# EAGLE design ESP_SIM7000V2.62 (EAGLE 9.6.2)

## Sheet 1 of 2
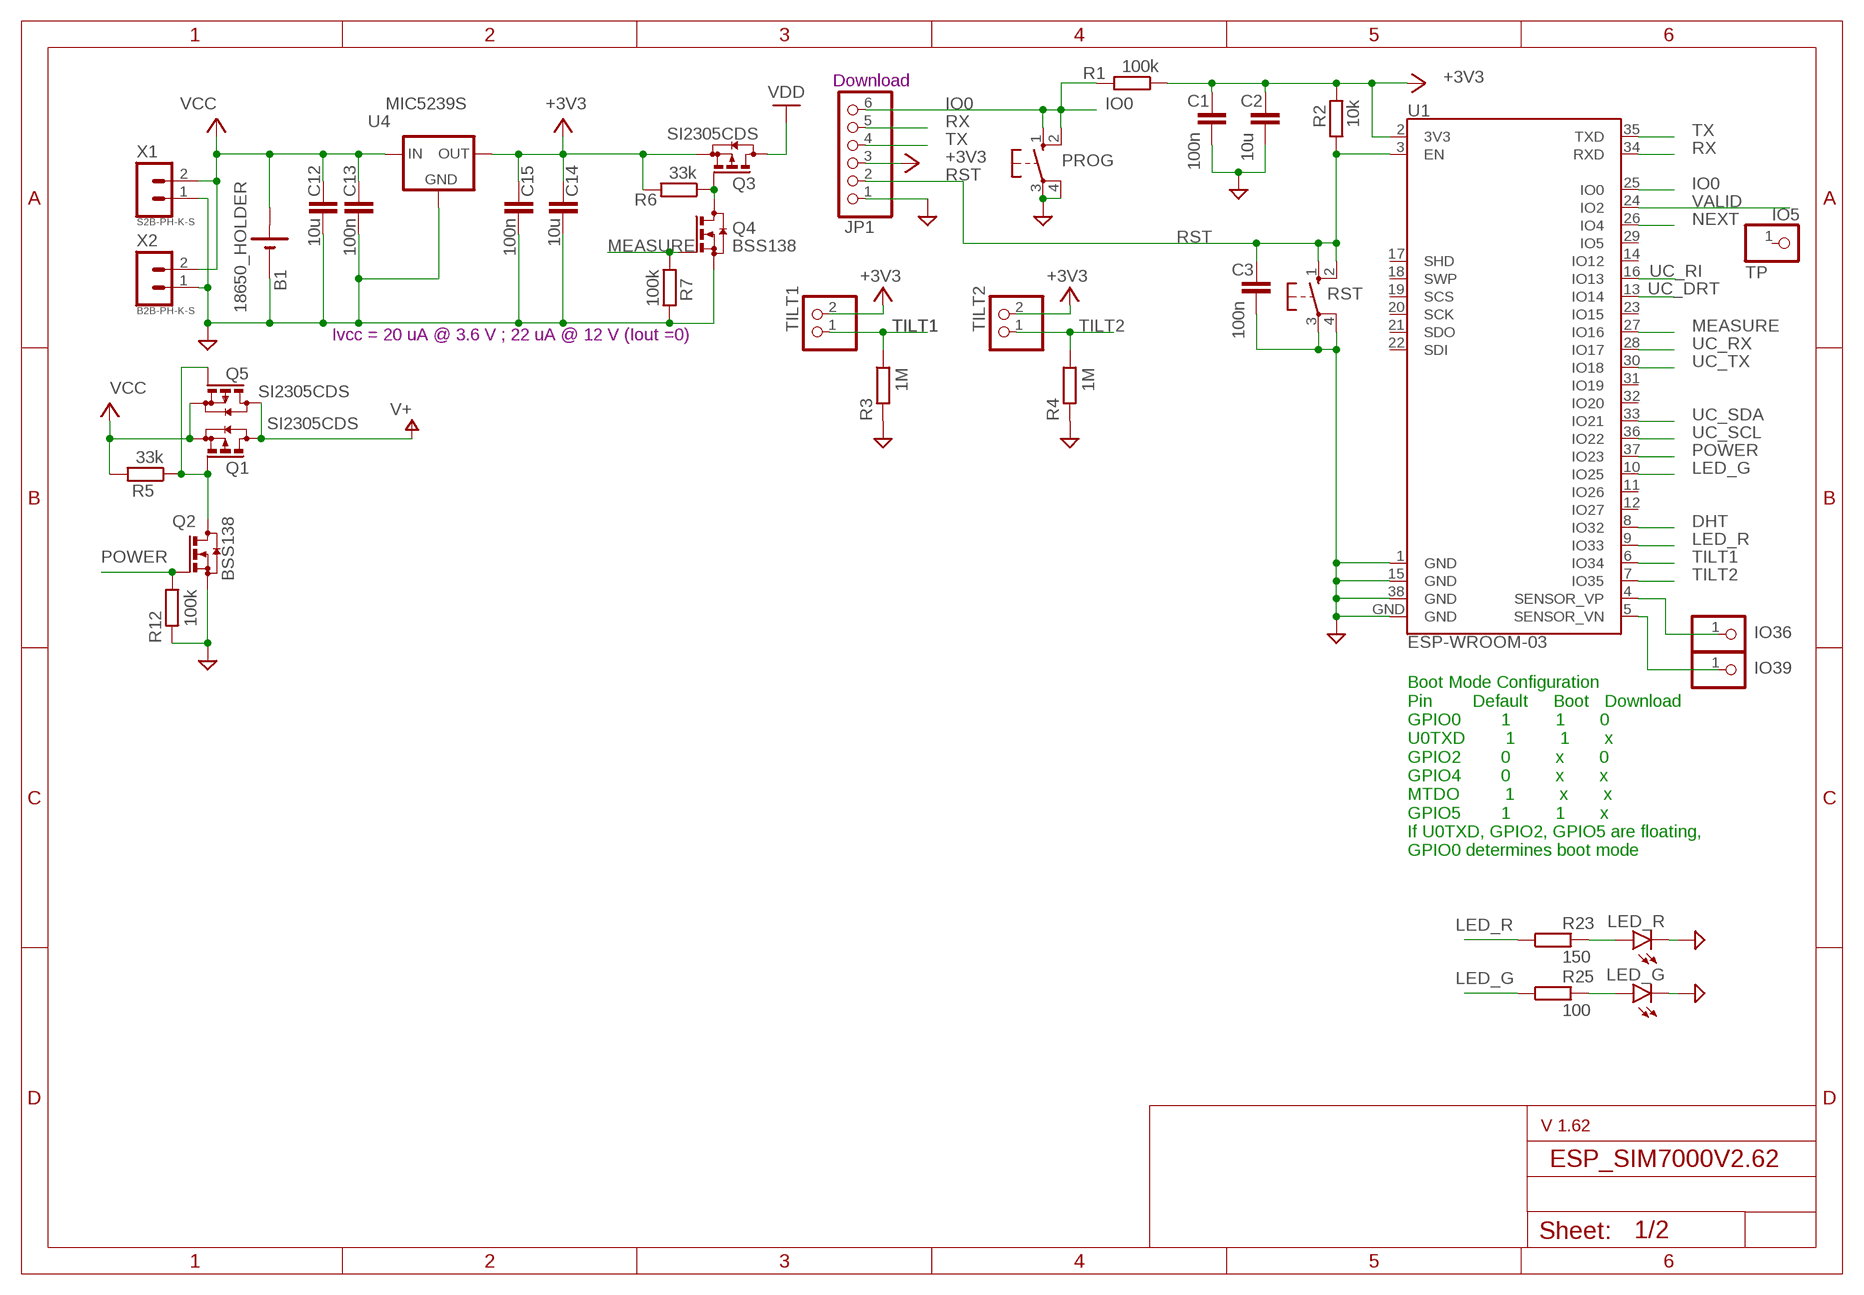
[diagram p0: schematic, sheet 1]

### Parts
B1  18650_HOLDER  [18650]
C1  100n  CC1206  [C1206]
C2  10u  CC1210  [C1210]
C3  100n  CC1206  [C1206]
C12  10u  CC1210  [C1210]
C13  100n  CC1206  [C1206]
C14  10u  CC1210  [C1210]
C15  100n  CC1206  [C1206]
IO5  TP  PINHD-1X1  [1X01]
IO36  PINHD-1X1  [1X01]
IO39  PINHD-1X1  [1X01]
JP1  PINHD-1X6  [1X06]
LED_G  LEDSMT1206  [1206]
LED_R  LEDSMT1206  [1206]
PROG  10-XX  [B3F-10XX]
Q1  SI2305CDS  [SOT23]
Q2  BSS138  BSS131  [SOT23]
Q3  SI2305CDS  [SOT23]
Q4  BSS138  BSS131  [SOT23]
Q5  SI2305CDS  [SOT23]
R1  100k  RR1206  [R1206]
R2  10k  RR1206  [R1206]
R3  1M  RR1206  [R1206]
R4  1M  RR1206  [R1206]
R5  33k  RR1206  [R1206]
R6  33k  RR1206  [R1206]
R7  100k  RR1206  [R1206]
R12  100k  RR1206  [R1206]
R23  150  RR1206  [R1206]
R25  100  RR1206  [R1206]
RST  10-XX  [B3F-10XX]
TILT1  PINHD-1X2  [1X02]
TILT2  PINHD-1X2  [1X02]
U1  ESP-WROOM-03  [ESP-WROOM-03]
U4  MIC5239S  [SOT223]
X1  S2B-PH-K-S  [S2B-PH-K-S]
X2  B2B-PH-K-S  [B2B-PH-K-S]

### Nets
+3V3: C1.1 C2.1 C14.1 C15.1 JP1.3 Q3.2(S) R1.1 R2.2 R6.2 TILT1.2 TILT2.2 U1.2(3V3) U4.3(OUT) ; also sheet 2
DHT: U1.8(IO32)
GND: B1.- C1.2 C2.2 C3.2 C12.2 C13.2 C14.2 C15.2 JP1.1 LED_G.C LED_R.C PROG.3(P) PROG.4(P1) Q2.2(S) Q4.2(S) R3.2 R4.2 R7.2 R12.2 RST.3(P) RST.4(P1) U1.1(GND) U1.15(GND) U1.38(GND) U1.GND U4.2(GND) U4.4(GND) X1.1 X2.1 ; also sheet 2
IO0: JP1.6 PROG.1(S) PROG.2(S1) R1.2 U1.25(IO0)
IO36: IO36.1 U1.4(SENSOR_VP)
IO39: IO39.1 U1.5(SENSOR_VN)
LED_G: R25.1 U1.10(IO25)
LED_R: R23.1 U1.9(IO33) ; also sheet 2
MEASURE: Q4.1(G) R7.1 U1.27(IO16)
N$1: Q1.1(G) Q2.3(D) Q5.1(G) R5.1
N$2: Q3.1(G) Q4.3(D) R6.1
N$7: LED_R.A R23.2
N$8: LED_G.A R25.2
N$17: IO5.1 U1.29(IO5)
NEXT: U1.26(IO4)
POWER: Q2.1(G) R12.1 U1.37(IO23)
RST: C3.1 JP1.2 R2.1 RST.1(S) RST.2(S1) U1.3(EN)
RX: JP1.5 U1.34(RXD)
TILT1: R3.1 TILT1.1 U1.6(IO34)
TILT2: R4.1 TILT2.1 U1.7(IO35)
TX: JP1.4 U1.35(TXD)
UC_DRT: U1.13(IO14) ; also sheet 2
UC_RI: U1.16(IO13) ; also sheet 2
UC_RX: U1.28(IO17) ; also sheet 2
UC_SCL: U1.36(IO22) ; also sheet 2
UC_SDA: U1.33(IO21) ; also sheet 2
UC_TX: U1.30(IO18) ; also sheet 2
V+: Q1.3(D) Q5.3(D) ; also sheet 2
VALID: U1.24(IO2)
VCC: B1.+ C12.1 C13.1 Q1.2(S) Q5.2(S) R5.2 U4.1(IN) X1.2 X2.2
VDD: Q3.3(D)
Unconnected: U1.11(IO26) U1.12(IO27) U1.14(IO12) U1.17(SHD) U1.18(SWP) U1.19(SCS) U1.20(SCK) U1.21(SDO) U1.22(SDI) U1.23(IO15) U1.31(IO19) U1.32(IO20)

### Notes on the sheet
- Download
- Ivcc = 20 uA @ 3.6 V ; 22 uA @ 12 V (Iout =0)
- Boot Mode Configuration
  Pin        Default     Boot   Download
  GPIO0        1         1       0
  U0TXD        1         1       x
  GPIO2        0         x       0
  GPIO4        0         x       x
  MTDO         1         x       x
  GPIO5        1         1       x
  If U0TXD, GPIO2, GPIO5 are floating, 
  GPIO0 determines boot mode
- V 1.62

## Sheet 2 of 2
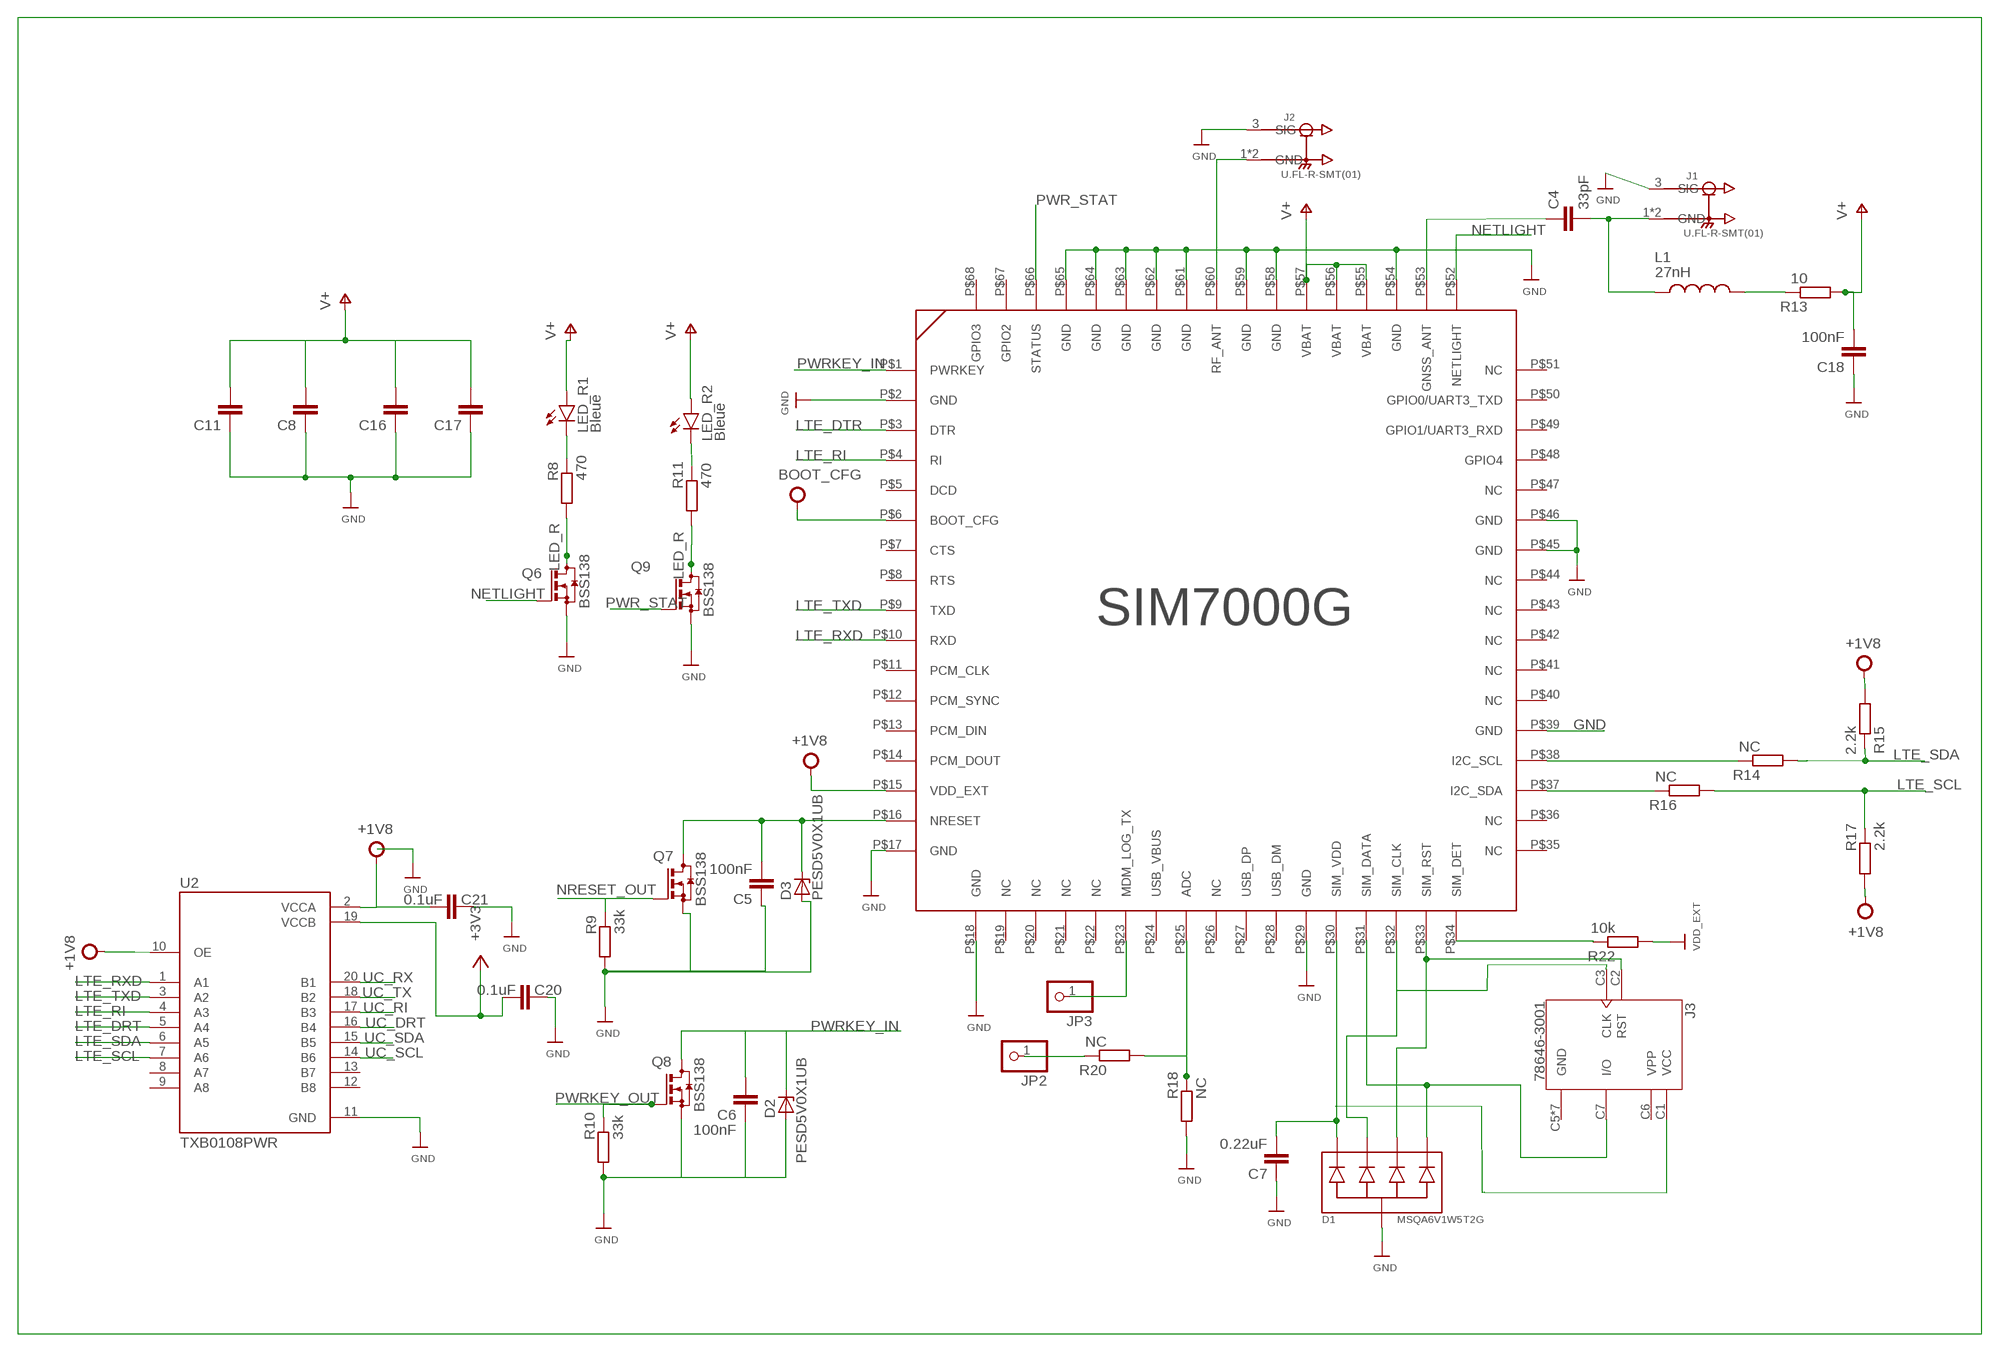
[diagram p1: schematic, sheet 2]

### Parts
C4  33pF  C-EUC0805  [C0805]
C5  100nF  C-EUC0805  [C0805]
C6  100nF  C-EUC0805  [C0805]
C7  0.22uF  C-EUC0805  [C0805]
C8  1uF  C-EUC0805  [C0805]
C11  0.1uF  C-EUC0805  [C0805]
C16  100uF  C-EUC0805  [C0805]
C17  100uF  C-EUC0805  [C0805]
C18  100nF  C-EUC0805  [C0805]
C20  0.1uF  CC1210  [C1210]
C21  0.1uF  CC1210  [C1210]
D1  MSQA6V1W5T2G  [SC88A]
D2  PESD5V0X1UB  [SOD523]
D3  PESD5V0X1UB  [SOD523]
J1  U.FL-R-SMT(01)  [HRS_U.FL-R-SMT(01)]
J2  U.FL-R-SMT(01)  [HRS_U.FL-R-SMT(01)]
J3  78646-3001  [MOLEX_78646-3001]
JP2  PINHD-1X1  [1X01]
JP3  PINHD-1X1  [1X01]
L1  27nH  LQM21PN1R0NGRD  [INDC2012X100N]
LED_R1  Bleue  LEDSMT1206  [1206]
LED_R2  Bleue  LEDSMT1206  [1206]
Q6  BSS138  BSS131  [SOT23]
Q7  BSS138  BSS131  [SOT23]
Q8  BSS138  BSS131  [SOT23]
Q9  BSS138  BSS131  [SOT23]
R8  470  RR1206  [R1206]
R9  33k  RR1206  [R1206]
R10  33k  RR1206  [R1206]
R11  470  RR1206  [R1206]
R13  10  RR1206  [R1206]
R14  NC  RR1206  [R1206]
R15  2.2k  RR1206  [R1206]
R16  NC  RR1206  [R1206]
R17  2.2k  RR1206  [R1206]
R18  NC  RR1206  [R1206]
R20  NC  RR1206  [R1206]
R22  10k  RR1206  [R1206]
U2  TXB0108PWR  [SOP65P640X120-20N]
U$1  SIM7000G  [SIM7000G]

### Nets
+1V8: C21.2 R15.1 R17.1 U2.2(VCCA) U2.10(OE) U$1.P$6(BOOT_CFG) U$1.P$15(VDD_EXT) ; supply symbol labelled BOOT_CFG
+3V3: C20.2 U2.19(VCCB) ; also sheet 1
GND: C5.1 C6.1 C7.1 C8.1 C11.1 C16.1 C17.1 C18.1 C20.1 C21.1 D1.2 D2.2(A) D3.2(A) J1.3(SIG) J2.3(SIG) Q6.2(S) Q7.2(S) Q8.2(S) Q9.2(S) R9.1 R10.1 R18.1 R22.1 U2.11(GND) U$1.P$2(GND) U$1.P$17(GND) U$1.P$18(GND) U$1.P$29(GND) U$1.P$39(GND) U$1.P$45(GND) U$1.P$46(GND) U$1.P$54(GND) U$1.P$58(GND) U$1.P$59(GND) U$1.P$61(GND) U$1.P$62(GND) U$1.P$63(GND) U$1.P$64(GND) U$1.P$65(GND) ; supply symbol labelled VDD_EXT ; also sheet 1
LED_R: Q6.3(D) Q9.3(D) R8.1 R11.1 ; also sheet 1
LTE_DRT: U2.5(A4)
LTE_DTR: U$1.P$3(DTR)
LTE_RI: U2.4(A3) U$1.P$4(RI)
LTE_RXD: U2.1(A1) U$1.P$10(RXD)
LTE_SCL: R16.1 R17.2 U2.7(A6)
LTE_SDA: R14.1 R15.2 U2.6(A5)
LTE_TXD: U2.3(A2) U$1.P$9(TXD)
N$3: J2.1(GND) J2.2(GND) U$1.P$60(RF_ANT)
N$4: C4.2 J1.1(GND) J1.2(GND) L1.1
N$5: C4.1 U$1.P$53(GNSS_ANT)
N$6: C5.2 D3.1(K) Q7.3(D) U$1.P$16(NRESET)
N$9: LED_R1.C R8.2
N$11: J3.C1(VCC)
N$13: D1.5 J3.C7(I/O) U$1.P$31(SIM_DATA)
N$14: D1.4 J3.C2(RST) U$1.P$33(SIM_RST)
N$32: JP2.1 R20.2
N$33: LED_R2.C R11.2
N$34: R22.2 U$1.P$34(SIM_DET)
N$36: L1.2 R13.2
N$37: D1.3 U$1.P$32(SIM_CLK)
N$38: R14.2 U$1.P$38(I2C_SCL)
N$39: R16.2 U$1.P$37(I2C_SDA)
N$40: C7.2 D1.1 U$1.P$30(SIM_VDD)
N$41: J3.C3(CLK)
N$42: R18.2 R20.1 U$1.P$25(ADC)
N$45: JP3.1 U$1.P$23(MDM_LOG_TX)
NETLIGHT: Q6.1(G) U$1.P$52(NETLIGHT)
NRESET_OUT: Q7.1(G) R9.2
PWR_STAT: Q9.1(G) U$1.P$66(STATUS)
PWRKEY_IN: C6.2 D2.1(K) Q8.3(D) U$1.P$1(PWRKEY)
PWRKEY_OUT: Q8.1(G) R10.2
UC_DRT: U2.16(B4) ; also sheet 1
UC_RI: U2.17(B3) ; also sheet 1
UC_RX: U2.20(B1) ; also sheet 1
UC_SCL: U2.14(B6) ; also sheet 1
UC_SDA: U2.15(B5) ; also sheet 1
UC_TX: U2.18(B2) ; also sheet 1
V+: C8.2 C11.2 C16.2 C17.2 C18.2 LED_R1.A LED_R2.A R13.1 U$1.P$55(VBAT) U$1.P$56(VBAT) U$1.P$57(VBAT) ; also sheet 1
Unconnected: U2.8(A7) U2.9(A8) U2.12(B8) U2.13(B7) U$1.P$5(DCD) U$1.P$7(CTS) U$1.P$8(RTS) U$1.P$11(PCM_CLK) U$1.P$12(PCM_SYNC) U$1.P$13(PCM_DIN) U$1.P$14(PCM_DOUT) U$1.P$19(NC) U$1.P$20(NC) U$1.P$21(NC) U$1.P$22(NC) U$1.P$24(USB_VBUS) U$1.P$26(NC) U$1.P$27(USB_DP) U$1.P$28(USB_DM) U$1.P$35(NC) U$1.P$36(NC) U$1.P$40(NC) U$1.P$41(NC) U$1.P$42(NC) U$1.P$43(NC) U$1.P$44(NC) U$1.P$47(NC) U$1.P$48(GPIO4) U$1.P$49(GPIO1/UART3_RXD) U$1.P$50(GPIO0/UART3_TXD) U$1.P$51(NC) U$1.P$67(GPIO2) U$1.P$68(GPIO3)

## Power pins joined to a net without a drawn wire
GND: J3.C5(GND) J3.G1(GND) J3.G2(GND) J3.G3(GND) J3.G4(GND) J3.G5(GND) J3.G6(GND)
VPP: J3.C6(VPP)

## Library data of the parts
B1 = battery_bms:18650_HOLDER: 18650 holder
C1-C3 C12-C15 C20 C21 = eagle-ltspice:C: CAPACITOR, European symbol; SPICEMODEL: NONE; SPICEPREFIX: C
C4-C8 C11 C16-C18 = rcl:C-EU: CAPACITOR, European symbol; SPICEPREFIX: C
D1 = MSQA6V1W5T2G:MSQA6V1W5T2G: ESD Protection Diode Array Check availability <https://pricing.snapeda.com/parts/MSQA6V1W5T2G/onsemi/view-part?ref=eda>; AVAILABILITY: In Stock; CHECK_PRICES: https://www.snapeda.com/parts/MSQA6V1W5T2G/Onsemi/view-part/?ref=eda; DESCRIPTION: Clamp Ipp Tvs Diode Surface Mount SC-88A (SC-70-5/SOT-353); MF: onsemi; MP: MSQA6V1W5T2G; PACKAGE: SC-88A-5 ON Semiconductor; PRICE: None; PURCHASE-URL: https://www.snapeda.com/api/url_track_click_mouser/?unipart_id=7122110&manufacturer=onsemi&part_name=MSQA6V1W5T2G&search_term=msqa6v1w5t2g; SNAPEDA_LINK: https://www.snapeda.com/parts/MSQA6V1W5T2G/Onsemi/view-part/?ref=snap
D2 D3 = PESD5V0X1UB:PESD5V0X1UB: Ultra low capacitance unidirectional ElectroStatic Discharge (ESD) protection diode in a SOD523 (SC-79) ultra small and flat lead Surface-Mounted Device (SMD) plastic package designed to protect one signal line from the damage caused by ESD and other transients. AAL Eindhoven MK Check availability <https://pricing.snapeda.com/parts/PESD5V0X1UB/Nexperia%20USA/view-part?ref=eda>; AVAILABILITY: In Stock; CHECK_PRICES: https://www.snapeda.com/parts/PESD5V0X1UB/Nexperia/view-part/?ref=eda; DESCRIPTION: 8V (Typ) Clamp 1.5A (8/20µs) Ipp Tvs Diode Surface Mount SOD-523; MF: Nexperia USA; MP: PESD5V0X1UB; PACKAGE: SOD-523 NXP Semiconductors; PRICE: None; SNAPEDA_LINK: https://www.snapeda.com/parts/PESD5V0X1UB/Nexperia/view-part/?ref=snap
IO5 IO36 IO39 JP2 JP3 = pinhead:PINHD-1X1: PIN HEADER
J1 J2 = U.FL-R-SMT_01_:U.FL-R-SMT(01): U.FL Series 6 Ghz 50 Ohm Ultra-small SMT Coaxial Cable Receptacle Check availability <https://pricing.snapeda.com/parts/U.FL-R-SMT%2801%29/Hirose/view-part?ref=eda>; AVAILABILITY: In Stock; CHECK_PRICES: https://www.snapeda.com/parts/U.FL-R-SMT(01)/Hirose+Electric+Co+Ltd/view-part/?ref=eda; DESCRIPTION: U.FL (UMCC) Connector Receptacle, Male Pin 50Ohm Surface Mount Solder. RF Connectors / Coaxial Connectors; MF: Hirose; MP: U.FL-R-SMT(01); PACKAGE: None; PRICE: None; PURCHASE-URL: https://www.snapeda.com/api/url_track_click_mouser/?unipart_id=49572&manufacturer=Hirose&part_name=U.FL-R-SMT(01)&search_term=None; SNAPEDA_LINK: https://www.snapeda.com/parts/U.FL-R-SMT(01)/Hirose+Electric+Co+Ltd/view-part/?ref=snap
J3 = SIM:78646-3001: Conn Micro SIM Card SKT 6 POS 2.54mm Solder RA SMD 0.5A/Contact Embossed T/R Check availability <https://pricing.snapeda.com/parts/78646-3001/Molex/view-part?ref=eda>; AVAILABILITY: In Stock; CHECK_PRICES: https://www.snapeda.com/parts/78646-3001/Molex/view-part/?ref=eda; DESCRIPTION: Horizontal Surface Mount Micro SIM Card Connector, with Push In Termination | Molex Incorporated 78646-3001; MF: Molex; MP: 78646-3001; PACKAGE: None; PRICE: None; PURCHASE-URL: https://www.snapeda.com/api/url_track_click_mouser/?unipart_id=75189&manufacturer=Molex&part_name=78646-3001&search_term=micro sim; SNAPEDA_LINK: https://www.snapeda.com/parts/78646-3001/Molex/view-part/?ref=snap
JP1 = pinhead:PINHD-1X6: PIN HEADER
L1 = LQM21PN1R0NGRD:LQM21PN1R0NGRD: LQM21PN 1uH 950mA 30% MLT; CHECK_PRICES: https://www.snapeda.com/parts/LQM21PN1R0NGRD/Murata+Electronics+North+America/view-part/?ref=eda; DESCRIPTION: Inductor with Inductance: 1uH Tol. +/-30%, Package: 0805 (2012); MF: Murata; MP: LQM21PN1R0NGRD; PACKAGE: 2012 Murata; PURCHASE-URL: https://www.snapeda.com/api/url_track_click_mouser/?unipart_id=1499484&manufacturer=Murata&part_name=LQM21PN1R0NGRD&search_term=inductance 0805; RS_COMPONENTS_1674235_PURCHASE_URL: https://www.snapeda.com/api/url_track_click/https%253A//uk.rs-online.com/web/p/surface-mount-inductors/1674235//%253Futm_campaign%253Dbuynow%2526utm_medium%253Daggregator%2526utm_source%253Dsnapeda%2526cm_mmc%253Daff-_-uk-_-snapeda-_-1674235/?unipart_id=1499484&manufacturer=Murata&part_name=LQM21PN1R0NGRD&search_term=inductance 0805; RS_COMPONENTS_7867096P_PURCHASE_URL: https://www.snapeda.com/api/url_track_click/https%253A//uk.rs-online.com/web/p/surface-mount-inductors/7867096p//%253Futm_campaign%253Dbuynow%2526utm_medium%253Daggregator%2526utm_source%253Dsnapeda%2526cm_mmc%253Daff-_-uk-_-snapeda-_-7867096P/?unipart_id=1499484&manufacturer=Murata&part_name=LQM21PN1R0NGRD&search_term=inductance 0805; RS_COMPONENTS_7867096_PURCHASE_URL: https://www.snapeda.com/api/url_track_click/https%253A//uk.rs-online.com/web/p/surface-mount-inductors/7867096//%253Futm_campaign%253Dbuynow%2526utm_medium%253Daggregator%2526utm_source%253Dsnapeda%2526cm_mmc%253Daff-_-uk-_-snapeda-_-7867096/?unipart_id=1499484&manufacturer=Murata&part_name=LQM21PN1R0NGRD&search_term=inductance 0805; SNAPEDA_LINK: https://www.snapeda.com/parts/LQM21PN1R0NGRD/Murata+Electronics+North+America/view-part/?ref=snap
LED_G LED_R LED_R1 LED_R2 = led:LED: LED OSRAM: - CHIPLED LG R971, LG N971, LY N971, LG Q971, LY Q971, LO R971, LY R971 LH N974, LH R974 LS Q976, LO Q976, LY Q976 LO Q996 - Hyper CHIPLED LW Q18S LB Q993, LB Q99A, LB R99A - SideLED LS A670, LO A670, LY A670, LG A670, LP A670 LB A673, LV A673, LT A673, LW A673 LH A674 LY A675 LS A676, LA A676, LO A676, LY A676, LW A676 LS A679, LY A679, LG A679 - Hyper Micro SIDELED® LS Y876, LA Y876, LO Y876, LY Y876 LT Y87S - SmartLED LW L88C, LW L88S LB L89C, LB L89S, LG L890 LS L89K, LO L89K, LY L89K LS L896, LA L896, LO L896, LY L896 - TOPLED LS T670, LO T670, LY T670, LG T670, LP T670 LSG T670, LSP T670, LSY T670, LOP T670, LYG T670 LG T671, LOG T671, LSG T671 LB T673, LV T673, LT T673, LW T673 LH T674 LS T676, LA T676, LO T676, LY T676, LB T676, LH T676, LSB T676, LW T676 LB T67C, LV T67C, LT T67C, LS T67K, LO T67K, LY T67K, LW E67C LS E67B, LA E67B, LO E67B, LY E67B, LB E67C, LV E67C, LT E67C LW T67C LS T679, LY T679, LG T679 LS T770, LO T770, LY T770, LG T770, LP T770 LB T773, LV T773, LT T773, LW T773 LH T774 LS E675, LA E675, LY E675, LS T675 LS T776, LA T776, LO T776, LY T776, LB T776 LHGB T686 LT T68C, LB T68C - Hyper Mini TOPLED® LB M676 - Mini TOPLED Santana® LG M470 LS M47K, LO M47K, LY M47K Source: http://www.osram.convergy.de LUXEON: - LUMILED® LXK2-PW12-R00, LXK2-PW12-S00, LXK2-PW14-U00, LXK2-PW14-V00 LXK2-PM12-R00, LXK2-PM12-S00, LXK2-PM14-U00 LXK2-PE12-Q00, LXK2-PE12-R00, LXK2-PE12-S00, LXK2-PE14-T00, LXK2-PE14-U00 LXK2-PB12-K00, LXK2-PB12-L00, LXK2-PB12-M00, LXK2-PB14-N00, LXK2-PB14-P00, LXK2-PB14-Q00 LXK2-PR12-L00, LXK2-PR12-M00, LXK2-PR14-Q00, LXK2-PR14-R00 LXK2-PD12-Q00, LXK2-PD12-R00, LXK2-PD12-S00 LXK2-PH12-R00, LXK2-PH12-S00 LXK2-PL12-P00, LXK2-PL12-Q00, LXK2-PL12-R00 Source: www.luxeon.com KINGBRIGHT: KA-3528ASYC Source: www.kingbright.com
PROG RST = switch-omron:10-XX: OMRON SWITCH; MPN: B3F-1000; OC_FARNELL: 176432; OC_NEWARK: 36M3542
Q1 Q3 Q5 = transistor-small-signal-perso:SI2305CDS: P-CHANNEL MOS FET
Q2 Q4 Q6-Q9 = transistor-small-signal-perso:BSS131: N-CHANNEL MOS FET
R1-R18 R20 R22 R23 R25 = eagle-ltspice:R: RESISTOR, European symbol; SPICEMODEL: NONE; SPICEPREFIX: R
TILT1 TILT2 = pinhead:PINHD-1X2: PIN HEADER
U1 = esp32-sparkfun (1):ESP-WROOM-03; OC_FARNELL: unknown
U2 = TXB0108PWR:TXB0108PWR: 8-Bit Bidirectional Voltage-Level Shifter with Auto Direction Sensing and +/-15-kV ESD Protect 20-TSSOP -40 to 85 Check availability <https://pricing.snapeda.com/parts/TXB0108PWR/Texas%20Instruments/view-part?ref=eda>; CHECK_PRICES: https://www.snapeda.com/parts/TXB0108PWR/Texas+Instruments/view-part/?ref=eda; DESCRIPTION: 8-Bit Bidirectional Voltage-Level Shifter with Auto Direction Sensing and +/-15-kV ESD Protect; MF: Texas Instruments; MP: TXB0108PWR; PACKAGE: TSSOP-20 Texas Instruments; PURCHASE-URL: https://www.snapeda.com/api/url_track_click_mouser/?unipart_id=45111&manufacturer=Texas Instruments&part_name=TXB0108PWR&search_term=txb0108; RS_COMPONENTS_7099038P_PURCHASE_URL: https://www.snapeda.com/api/url_track_click/https%253A//uk.rs-online.com/web/p/translator-ics/7099038p//%253Futm_campaign%253Dbuynow%2526utm_medium%253Daggregator%2526utm_source%253Dsnapeda%2526cm_mmc%253Daff-_-uk-_-snapeda-_-7099038P/?unipart_id=45111&manufacturer=Texas Instruments&part_name=TXB0108PWR&search_term=txb0108; RS_COMPONENTS_7099038_PURCHASE_URL: https://www.snapeda.com/api/url_track_click/https%253A//uk.rs-online.com/web/p/translator-ics/7099038//%253Futm_campaign%253Dbuynow%2526utm_medium%253Daggregator%2526utm_source%253Dsnapeda%2526cm_mmc%253Daff-_-uk-_-snapeda-_-7099038/?unipart_id=45111&manufacturer=Texas Instruments&part_name=TXB0108PWR&search_term=txb0108; RS_COMPONENTS_9215119_PURCHASE_URL: https://www.snapeda.com/api/url_track_click/https%253A//uk.rs-online.com/web/p/translator-ics/9215119//%253Futm_campaign%253Dbuynow%2526utm_medium%253Daggregator%2526utm_source%253Dsnapeda%2526cm_mmc%253Daff-_-uk-_-snapeda-_-9215119/?unipart_id=45111&manufacturer=Texas Instruments&part_name=TXB0108PWR&search_term=txb0108; SNAPEDA_LINK: https://www.snapeda.com/parts/TXB0108PWR/Texas+Instruments/view-part/?ref=snap
U4 = micrel:MIC5239S: LDO REGULATOR
U$1 = SIM7000G:SIM7000G; CHECK_PRICES: https://www.snapeda.com/parts/SIM7000G/SIMCom/view-part/?ref=eda; DESCRIPTION: 802.15.4 Cat-M, Cat-NB, EDGE, GPRS, LPWA Transceiver Module 850MHz, 900MHz, 1.8GHz, 1.9GHz Antenna Not Included Surface Mount; MF: SIMCom Wireless Solutions Limited; MP: SIM7000G; PACKAGE: None; PURCHASE-URL: https://www.snapeda.com/api/url_track_click_mouser/?unipart_id=12130268&manufacturer=SIMCom Wireless Solutions Limited&part_name=SIM7000G&search_term=sim7000g; SNAPEDA_LINK: https://www.snapeda.com/parts/SIM7000G/SIMCom/view-part/?ref=snap
X1 = con-JST PH:S2B-PH: JST PH series header 2.00mm pitch disconnectable crimp style connectors, horizontal (side entry type), 2 pins
X2 = con-JST PH:B2B-PH: JST PH series header 2.00mm pitch disconnectable crimp style connectors, vertical (side entry type), 2 pins

## Board
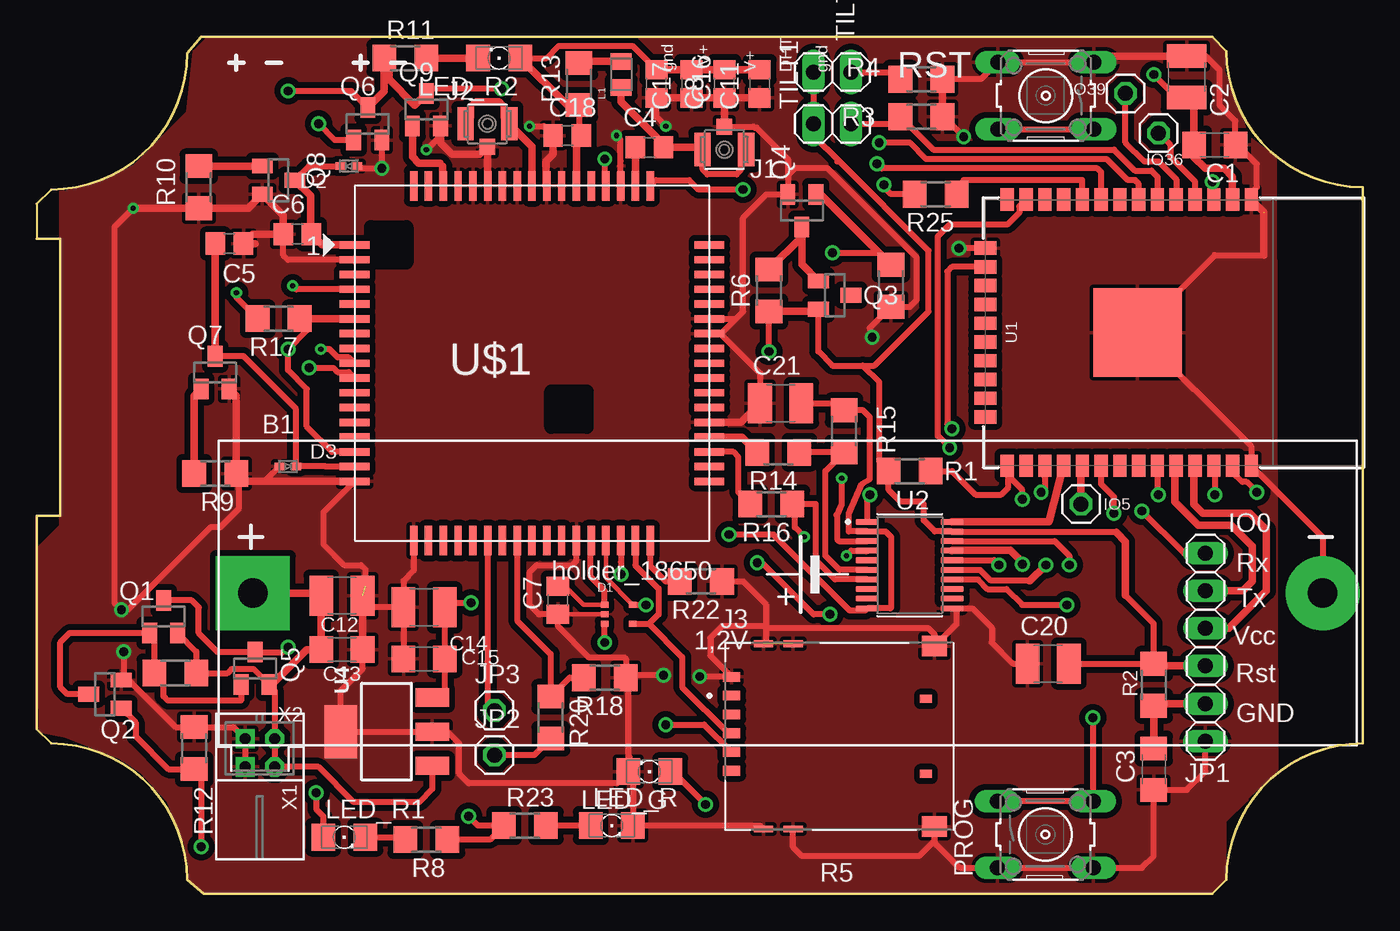
[diagram p2: board, top side]
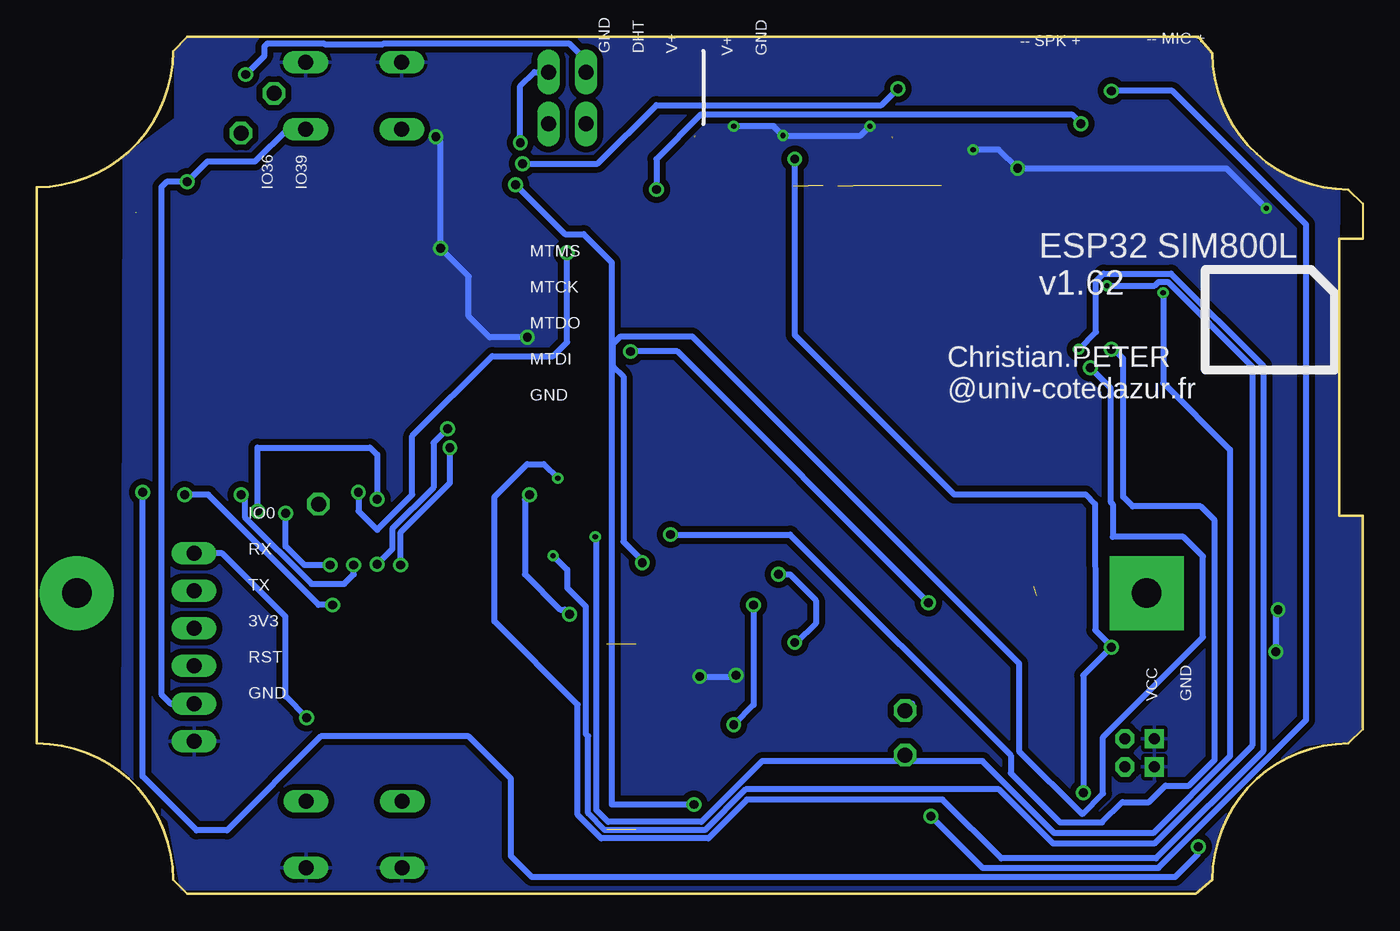
[diagram p3: board, bottom side, seen from below]

Size 89.69 x 57.94 mm. Coordinates in mm from the lower left corner, seen from the top.
Outline: 0.95,10.16 arc-90 10.16,0.95
Outline: 10.16,0.95 11.27,0 79.53,0 80.49,0.95 arc-90 89.69,10.16 89.69,47.78 arc-90 80.49,56.99 79.53,57.94 11.11,57.94 10.16,56.83 arc-90 0.95,47.62 0,46.67 0,44.29 1.59,44.29 1.59,25.56 0,25.56 0,11.11 0.95,10.16
Outline: 0.95,10.16 arc-90 10.16,0.95
Copper layers (1*16): Top 0.035mm / dielectric 1.5mm / Bottom 0.035mm
Design rules "default *": minimum track width 6mil, minimum drill 0.35mm, track to track 6mil, track to pad 6mil, pad to pad 6mil, via to via 6mil, smd to smd 6mil, copper to edge 0mil, drill to drill 6mil, minimum pad ring 10mil, minimum via ring 8mil, stop-mask expansion 4mil, vias tented up to drill 0mil, thermal gap 10mil

### Footprints (pad centres in the part's own frame; a part is rotated, then mirrored left to right if it is on the bottom)
18650 = drill 2 pad 5 square: + -36.2,0 | drill 2 pad 5: - 36.2,0
C1206 = smd 1.6 x 1.8: 1 -1.4,0; 2 1.4,0
C1210 = smd 1.6 x 2.7: 1 -1.4,0; 2 1.4,0
C0805 = smd 1.3 x 1.5: 1 -0.95,0; 2 0.95,0
SC88A = smd 0.5 x 0.4: 1 0,0.65; 2 0,0; 3 0,-0.65; 4 1.9,-0.65; 5 1.9,0.65
SOD523 = smd 0.7 x 0.5: 1 0.55,0; 2 -0.55,0
1X01 = drill 1.016 octagon: 1 0,0
HRS_U.FL-R-SMT(01) = smd 1.1 x 2.25: 1 -1.475,0; 2 1.475,0 | smd 1.05 x 1.1: 3 0,-1.55
MOLEX_78646-3001 = smd 1.15 x 0.65: C1 -7.295,2.755; C2 -7.295,0.215; C3 -7.295,-2.325; C5 -7.295,4.025; C6 -7.295,1.485; C7 -7.295,-1.055 | smd 1.3 x 0.45: G1 -5.125,6.27; G2 -3.125,6.27; G3 -5.125,-6.27; G4 -3.125,-6.27 | smd 1.7 x 1.4: G5 6.435,-6.105; G6 6.435,6.105 | smd 0.8 x 0.54: X1 5.855,2.54; X2 5.855,-2.54
1X06 = drill 1.016 long: 1 -6.35,0; 2 -3.81,0; 3 -1.27,0; 4 1.27,0; 5 3.81,0; 6 6.35,0
INDC2012X100N = smd 1.1 x 1.42: 1 -0.885,0; 2 0.885,0
1206 = smd 1.6 x 1.803: A -1.422,0; C 1.422,0
B3F-10XX = drill 1.016 long: 1 -3.251,2.261; 2 3.251,2.261; 3 -3.251,-2.261; 4 3.251,-2.261
SOT23 = smd 1 x 1.4: 1 -0.95,-1.1; 2 0.95,-1.1; 3 0,1.1
R1206 = smd 1.6 x 1.803: 1 -1.422,0; 2 1.422,0
1X02 = drill 1.016 long: 1 -1.27,0; 2 1.27,0
ESP-WROOM-03 = smd 0.9 x 1.5: 1 7.7,9; 2 6.43,9; 3 5.16,9; 4 3.89,9; 5 2.62,9; 6 1.35,9; 7 0.08,9; 8 -1.19,9; 9 -2.46,9; 10 -3.73,9; 11 -5,9; 12 -6.27,9; 13 -7.54,9; 14 -8.81,9; 25 -8.81,-9; 26 -7.54,-9; 27 -6.27,-9; 28 -5,-9; 29 -3.73,-9; 30 -2.46,-9; 31 -1.19,-9; 32 0.08,-9; 33 1.35,-9; 34 2.62,-9; 35 3.89,-9; 36 5.16,-9; 37 6.43,-9; 38 7.7,-9 | smd 1.5 x 0.9: 15 -10.3,5.715; 16 -10.3,4.445; 17 -10.3,3.175; 18 -10.3,1.905; 19 -10.3,0.635; 20 -10.3,-0.635; 21 -10.3,-1.905; 22 -10.3,-3.175; 23 -10.3,-4.445; 24 -10.3,-5.715 | smd 6 x 6: GND 0,0
SOP65P640X120-20N = smd 1.57 x 0.41: 1 -2.87,2.925; 2 -2.87,2.275; 3 -2.87,1.625; 4 -2.87,0.975; 5 -2.87,0.325; 6 -2.87,-0.325; 7 -2.87,-0.975; 8 -2.87,-1.625; 9 -2.87,-2.275; 10 -2.87,-2.925; 11 2.87,-2.925; 12 2.87,-2.275; 13 2.87,-1.625; 14 2.87,-0.975; 15 2.87,-0.325; 16 2.87,0.325; 17 2.87,0.975; 18 2.87,1.625; 19 2.87,2.275; 20 2.87,2.925
SOT223 = smd 1.219 x 2.235: 1 -2.311,-3.099; 2 0,-3.099; 3 2.311,-3.099 | smd 3.6 x 2.2: 4 0,3.099
SIM7000G = smd 2 x 0.5: P$1 -12,8; P$2 -12,7; P$3 -12,6; P$4 -12,5; P$5 -12,4; P$6 -12,3; P$7 -12,2; P$8 -12,1; P$9 -12,0; P$10 -12,-1; P$11 -12,-2; P$12 -12,-3; P$13 -12,-4; P$14 -12,-5; P$15 -12,-6; P$16 -12,-7; P$17 -12,-8; P$35 12,-8; P$36 12,-7; P$37 12,-6; P$38 12,-5; P$39 12,-4; P$40 12,-3; P$41 12,-2; P$42 12,-1; P$43 12,0; P$44 12,1; P$45 12,2; P$46 12,3; P$47 12,4; P$48 12,5; P$49 12,6; P$50 12,7; P$51 12,8 | smd 0.5 x 2: P$18 -8,-12; P$19 -7,-12; P$20 -6,-12; P$21 -5,-12; P$22 -4,-12; P$23 -3,-12; P$24 -2,-12; P$25 -1,-12; P$26 0,-12; P$27 1,-12; P$28 2,-12; P$29 3,-12; P$30 4,-12; P$31 5,-12; P$32 6,-12; P$33 7,-12; P$34 8,-12; P$52 8,12; P$53 7,12; P$54 6,12; P$55 5,12; P$56 4,12; P$57 3,12; P$58 2,12; P$59 1,12; P$60 0,12; P$61 -1,12; P$62 -2,12; P$63 -3,12; P$64 -4,12; P$65 -5,12; P$66 -6,12; P$67 -7,12; P$68 -8,12
S2B-PH-K-S = drill 0.75 pad 1.3 square: 1 1,0 | drill 0.75 pad 1.3 octagon: 2 -1,0
B2B-PH-K-S = drill 0.75 pad 1.3 square: 1 1,0 | drill 0.75 pad 1.3 octagon: 2 -1,0

### Placement (x,y rotation side)
B1  50.8,20.32 0 top
C1  79.69,50.64 0 top
C2  77.79,55.24 90 top
C3  75.56,8.41 270 top
C4  41.44,50.48 0 top
C5  13.02,43.97 180 top
C6  17.62,44.61 0 top
C7  35.24,19.84 90 top
C8  46.51,54.77 90 top
C11  48.9,54.77 90 top
C12  20.64,20.16 0 top
C13  20.64,16.51 0 top
C14  26.19,19.37 180 top
C15  26.19,15.88 180 top
C16  41.91,54.77 90 top
C17  44.29,54.77 90 top
C18  35.88,51.28 0 top
C20  68.42,15.56 0 top
C21  50.32,33.18 0 top
D1  38.42,18.89 0 top
D2  21.11,49.21 180 top
D3  16.99,28.89 0 top
IO5  70.64,26.35 0 top
IO36  75.88,51.44 0 top
IO39  73.66,54.13 90 top
J1  46.51,50.32 180 top
J2  30.48,52.07 0 top
J3  54.29,10.64 0 top
JP1  79.06,16.67 90 top
JP2  30.96,9.37 0 top
JP3  30.96,12.38 0 top
L1  39.53,55.4 90 top
LED_G  41.43,8.25 180 top
LED_R  38.89,4.6 0 top
LED_R1  20.8,3.81 0 top
LED_R2  31.27,56.52 180 top
PROG  68.23,4 0 top
Q1  8.57,18.73 0 top
Q2  4.6,13.49 90 top
Q3  53.98,40.48 270 top
Q4  51.75,46.2 180 top
Q5  14.76,15.24 0 top
Q6  22.38,52.07 0 top
Q7  12.07,35.24 0 top
Q8  16.35,48.26 270 top
Q9  26.35,53.02 0 top
R1  59.05,28.57 0 top
R2  75.56,14.13 90 top
R3  59.85,52.55 0 top
R4  59.85,55.09 0 top
R5  9.37,14.92 0 top
R6  49.53,40.8 270 top
R7  57.78,41.12 270 top
R8  26.35,3.65 180 top
R9  12.07,28.42 180 top
R10  10.95,47.78 90 top
R11  24.92,56.52 0 top
R12  10.64,9.84 90 top
R13  36.67,54.77 90 top
R14  50.16,29.84 180 top
R15  54.61,31.27 270 top
R16  49.69,26.35 180 top
R17  16.35,38.89 180 top
R18  38.42,14.61 180 top
R20  34.77,11.91 270 top
R22  44.93,21.11 180 top
R23  33.02,4.6 0 top
R25  60.8,47.31 180 top
RST  68.26,53.98 180 top
TILT1  53.82,52.07 180 top
TILT2  53.82,55.56 180 top
U1  74.46,37.95 0 top
U2  59.05,22.23 0 top
U4  23.65,10.95 90 top
U$1  33.5,35.88 0 top
X1  15.08,8.57 180 top
X2  15.08,10.48 180 top

### Tracks (layer width: path | path; a pad name or v marks a point on that pad's centre or on a via)
+1V8  (via drill 0.6)
  Top 0.406: C21.2 54.13,33.18 R15.1 55.89,32.7 56.36,32.23 56.36,28.04 55.84,27.72 54.93,25.68 54.93,24.5 U2.2 57.42,24.5 57.79,24.13 57.79,19.37 57.72,19.3 U2.10 56.03,19.14 55,19.14 49.85,24.29 v46.83,24.29 | 18.26,38.88 18.26,38.1 v16.99,36.83 16.99,35.4 18.26,34.13 18.26,31.59 19.97,29.88 U$1.P$15
  Top 0.508: U$1.P$6 18.26,38.88 17.79,38.88 R17.1
  Bottom 0.406: v46.83,24.29 38.74,24.29 23.8,9.35 23.8,8.14 20.47,4.81 17.63,4.81 16.25,6.19 14.45,6.19 13.34,7.3 11.75,7.3 10,9.05 10,25.24 10.95,26.19 15.56,26.19 16.19,26.83 16.19,36.19 16.83,36.83 v16.99,36.83
+3V3  (via drill 0.6)
  Top 0.406: U4.3 26.84,13.18 27.62,13.18 27.59,13.2 C15.1 C14.1 27.91,19.68 v29.37,19.68 | 73.03,24.45 61.93,24.45 U2.19 60.75,24.5 60.01,25.24 60.01,26.35 59.85,26.51 58.42,26.51 57.63,27.3 R1.1 | C20.2 76.04,15.56 76.2,15.4 | R2.2 75.57,18.26 73.66,20.17 | R1.1 | R1.1 56.99,29.22 56.99,34.61 55.88,35.72 | Q3.2 52.86,39.52 52.86,36.67 53.82,35.72 55.88,35.72 | TILT2.2 TILT1.2 52.55,51.28 54.29,49.53 | 55.88,35.72 56.67,35.72 60.33,39.37 60.33,43.5 54.29,49.53 | 54.29,49.53 54.13,49.53 | v49.53,36.67 49.53,39.22 49.69,39.38 | C2.1 77.12,53.84 v75.57,55.4
  Top 0.508: R2.2 75.72,15.4 76.2,15.4 JP1.3 | Q3.2 52.72,39.38 49.69,39.38 R6.2 | 73.66,20.17 73.66,23.81 73.03,24.45 | C2.1 78.29,53.34 C1.1 78.29,49.82 79.06,49.05 80.33,49.05 80.89,48.49 U1.2
  Bottom 0.406: v29.37,19.68 46.36,36.67 v49.53,36.67 | v75.57,55.4 74.3,56.67 74.3,57.31 74.09,57.51 70.29,57.51 70.24,57.47 66.28,57.47 66.24,57.51 53.7,57.51 52.55,56.36 TILT2.2
GND  (via drill 0.35, 0.6)  (10 unrouted)
  Top 0.305: D1.2 C7.1
  Top 0.406: C14.2 C15.2 | C14.2 22.83,19.37 C12.2 | U$1.P$18 25.5,21.84 24.79,21.14 C14.2 | R22.1 47.78,21.11 49.33,19.57 49.33,18.1 | J3.G1 49.33,17.06 49.33,17.94 | 49.33,18.1 49.33,17.94 | U$1.P$2 21.48,42.86 16.99,42.86 16.67,43.18 C6.1 | U2.11 62.23,19.3 | 62.23,19.3 63.28,19.3 64.61,17.97 64.61,16.99 66.04,15.56 C20.1 | 40.25,8.49 LED_G.C | LED_G.C 40.09,8.18 | 40.09,8.18 40.32,7.95 LED_R.C 48.93,4.6 J3.G3 | Q6.2 v23.33,49.06 | v23.33,49.06 v23.34,49.05 | D3.2 15.42,27.88 14.29,27.88 | C2.2 79.09,56.64 80.01,55.72 80.01,53.34 81.09,52.26 81.09,50.8 | C1.2 81.09,50.8 | D2.2 21.82,49.06 v23.33,49.06 | Q2.2 5.87,14.44 | 5.87,14.44 6.22,14.44 9.4,11.26 R12.2 13.29,11.26 X2.1 X1.1 | C13.2 22.04,15.21 20.55,13.73 U4.4 U4.2 27.78,10.95 28.58,10.16 28.58,8.1 29.21,7.46 39.22,7.46 LED_G.C | 62.23,19.3 62.23,18.24 J3.G6 60.73,17.54 60.33,17.94 49.33,17.94 | 40.09,9.28 40.09,8.18 | R9.1 13.65,28.25 13.65,26.03 12.38,24.76 11.75,24.76 6.19,19.21 v5.72,19.21 5.24,19.68 5.24,45.08 v6.51,46.35 | v5.87,16.35 5.87,14.44 | JP1.1 79.06,8.25 77.82,7.01 C3.2 75.57,2.54 74.77,1.74 PROG.4 PROG.3 62.51,1.74 62.42,1.76 60.7,3.47 60.7,4.5 J3.G5 60.73,3.58 59.69,2.54 51.75,2.54 51.17,3.12 J3.G4 | RST.3 RST.4 63.86,55.09 R4.2 | U$1.P$17 19.37,25.75 19.37,23.65 20.8,22.22 21.91,22.22 22.23,21.91 22.23,20.8 | U$1.P$46 47.29,38.88 | 47.29,38.88 47.78,39.37 47.78,45.72 49.36,47.3 Q4.2 50.8,48.58 | 47.29,38.88 46.29,37.88 U$1.P$45 46.26,37.88 48.92,35.21 C21.1 | 50.8,48.58 51.28,49.05 53.5,49.05 59.53,43.02 59.53,40.16 59.06,39.69 R7.2 56.36,38.27 56.36,37.78 v56.52,37.62 | U$1.P$29 36.5,22.53 36.2,22.22 33.81,22.22 33.34,21.75 33.34,19.53 33.97,18.89 33.98,18.89 C7.1 35.25,18.09 37.37,15.97 39.75,15.97 39.85,15.87 R18.1
  Top 0.406: LED_G.C 40.01,14.43 | 40.01,14.43 R18.1 | R18.1 | 83.03,43.18 79.7,43.18 U1.GND 82.16,30.25 U1.38 87,24.11 B1.- | 82.16,47.4 82.55,47.78 82.55,49.34 81.09,50.8 | U1.15 v62.4,43.66 v62.39,43.66 | v62.71,51.18 61.35,52.54 61.31,52.54 | 49.33,18.1 46.36,18.1 45.56,17.3 45.56,16.1 J3.C5 44.98,14.66 44.93,14.6 v44.85,14.68 | v42.39,14.76 40.34,14.76 40.01,14.43 | J1.3 48.46,51.87 48.53,51.8 48.69,51.8 50.8,49.69 50.8,48.58 | U$1.P$54 39.5,49.57 39.48,49.58 39.48,51.01 v39.21,51.28 | v33.34,51.91 34.29,51.91 C18.1 | v42.55,51.91 41.91,52.54 C16.1 | v26.35,50.32 27.3,51.27 Q9.2
  Top 0.508: U$1.P$17 14.29,27.88 14.03,27.88 R9.1 13.49,33.67 Q7.2 | 14.77,43.97 C5.1 14.61,44.61 C6.1 16.67,45.89 Q8.2 14.3,46.36 R10.1 v6.51,46.35 | U$1.P$63 30.5,50.5 J2.3 29.97,50.01 28.1,50.01 27.3,50.8 Q9.2 | C16.1 C17.1 C8.1 | C8.1 C11.1 | C8.1 J1.3 | C18.1 34.93,50.01 34.45,49.53 34.45,47.92 U$1.P$59 | C21.1 47.62,31.88 U$1.P$39 | R4.2 R3.2 61.31,52.54 | 64.85,56.24 RST.4 | C2.2 71.92,56.64 RST.3 | 82.16,47.4 U1.1 83.03,46.09 | 83.03,43.18 83.03,46.04 | 74.63,37.78 U1.GND | C12.2 C13.2
  Bottom 0.406: v6.51,46.35 9.21,49.05 v23.34,49.05 24.61,50.32 v26.35,50.32 | v5.72,19.21 5.87,19.05 v5.87,16.35 | v62.71,51.18 62.39,50.86 v62.39,43.66 60.48,41.75 60.48,39.05 59.06,37.62 v56.52,37.62 | v44.85,14.68 42.78,14.68 42.7,14.6 42.55,14.6 v42.39,14.76 | v33.34,51.91 33.97,51.28 v39.21,51.28 39.85,51.91 v42.55,51.91
  pour Top (isolate 0.406): 11.27,0 10.32,0.79 10.32,1.75 10,3.49 8.89,6.19 6.98,8.25 5.56,9.21 1.94,10.6 0.18,10.95 0.07,23.4 1.59,24.92 1.59,47.47 1.91,47.47 4.76,48.26 6.51,49.21 10.18,52.88 10.61,56.96 11.43,57.78 79.53,57.78 80.33,56.99 80.33,55.56 81.98,51.18 83.82,49.81 83.93,8.33 81.9,6.43 81.9,6.33 80.41,4.85 80.41,1.04 79.38,0
  pour Bottom (isolate 0.406): 10.98,0.29 10.32,0.95 10.32,2.06 9.84,4.13 9.05,5.87 7.78,7.46 6.35,8.73 3.97,10 1.75,10.32 0.95,10.32 0.16,11.11 0,25.4 1.75,25.4 1.59,47.47 3.65,47.94 5.4,48.58 6.83,49.53 8.1,50.64 8.89,51.75 10,54.13 10.32,56.83 11.27,57.78 79.53,57.78 80.33,56.99 80.33,52.41 83.83,49.81 83.94,8.45 81.21,5.89 81.21,5.32 80.79,4.91 79.93,0.29
IO0  (via drill 0.6)
  Top 0.406: R1.2 61.91,28.57 63.5,26.99 65.25,26.99 65.72,27.46 65.72,28.26 | 65.72,28.26 65.72,28.88 U1.25 | PROG.1 PROG.2 71.48,11.86 v71.44,11.91 | JP1.6 77.63,23.02 v74.77,25.88 | v66.68,26.67 66.68,27.3 65.72,28.26
  Bottom 0.406: v71.44,11.91 72.87,13.33 72.87,18.73 77.15,23.02 JP1.6 | v74.77,25.88 74.77,30.16 67.15,30.16 66.68,29.69 v66.68,26.67
IO36
  Top 0.406: IO36.1 76.68,50.64 76.68,49.85 78.35,48.17 U1.4
IO39
  Top 0.406: U1.5 77.08,48.33 75.88,49.53 74.93,49.53 73.66,50.8 IO39.1
LED_G
  Top 0.406: U1.10 70.73,48.26 62.71,48.26 62.22,47.78 R25.1
LED_R  (via drill 0.6)
  Top 0.406: R8.1 30.65,3.65 R23.1 29.85,4.6 v29.21,5.24 | v16.99,54.29 21.26,54.29 Q6.3 | U1.9 72,48.8 71.76,49.05 57.15,49.05 v56.83,49.37 | v31.43,54.45 26.68,54.45 Q9.3
  Top 0.508: Q9.3 25.57,53.34 23.82,55.09 23.82,56.2 R11.1 23.5,54.29 Q6.3
  Bottom 0.406: v29.21,5.24 25.72,1.75 13.81,1.75 3.81,11.75 3.81,45.24 12.86,54.29 v16.99,54.29 | v56.83,49.37 51.75,49.37 47.78,53.34 32.54,53.34 v31.43,54.45
LTE_RI  (via drill 0.35)
  Top 0.406: U$1.P$4 17.54,40.88 v17.3,41.12 | 56.12,23.13 U2.4 55.11,23.2 v54.77,22.86
  Bottom 0.406: v17.3,41.12 14.06,41.12 13.8,41.37 13.19,41.37 7.46,35.64 7.46,10.01 14.09,3.38 20.94,3.38 24.61,7.05 41.75,7.05 44.5,4.3 51.28,4.3 52.41,5.42 52.41,10.65 52.55,10.79 52.55,19.42 53.82,20.69 53.82,21.91 v54.77,22.86
LTE_RXD  (via drill 0.6)
  Top 0.406: U2.1 56.19,26.82 v56.36,26.99 | v53.66,18.89 52.55,18.89 48.9,22.54 v48.74,22.38 | U$1.P$10 21.1,35.27 20.35,35.27 20.06,35.56 v18.42,35.56
  Bottom 0.406: v56.36,26.99 56.67,26.67 56.67,21.59 54.29,19.21 53.98,19.21 v53.66,18.89 | v48.74,22.38 48.74,22.54 50.01,23.81 50.01,34.98 50.71,35.68 50.71,37.19 50.2,37.69 45.36,37.69 23.24,15.57 23.24,9.65 18.97,5.37 17.56,6.79 17.56,10.59 10.79,17.35 10.79,22.81 12.11,24.13 16.9,24.13 16.9,26.35 17.06,26.51 17.06,34.21 v18.42,35.56
LTE_SCL  (via drill 0.35)
  Top 0.406: 51.28,26.35 52.71,26.35 52.71,22.54 54,21.25 U2.7 | 51.28,26.35 R16.1 | R17.2 13.49,40.33 v13.49,40.64 | v51.91,24.13 51.28,24.76 51.28,26.35
  Bottom 0.406: v13.49,40.64 13.49,34.55 8.97,30.02 8.97,9.29 14.16,4.1 20.86,4.1 25.72,8.95 40.63,8.95 44.73,4.86 51.05,4.86 51.85,5.65 51.85,24.06 v51.91,24.13
LTE_SDA
  Top 0.406: R15.2 54.45,29.84 | 54.45,29.84 R14.1 | U2.6 54.3,21.9 53.34,22.86 53.34,28.57 54.93,30.16 54.77,30.16 54.45,29.84
LTE_TXD  (via drill 0.35)
  Top 0.406: U$1.P$9 21.1,36.27 20.35,36.27 19.79,36.83 v19.21,36.83 | v54.45,28.1 54.45,26.34 54.14,25.64 54.13,25.63 | 54.1,25.6 54.13,25.63 | 54.13,25.63 54.13,23.97 54.26,23.85 U2.3
  Bottom 0.406: v19.21,36.83 18.04,38 18.04,41.42 17.53,41.93 12.96,41.93 6.73,35.71 6.73,9.62 13.97,2.38 24.45,2.38 28.42,6.35 41.66,6.35 44.27,3.74 51.51,3.74 53.11,5.33 53.11,12.78 58.74,18.41 58.74,26.83 56.52,29.05 55.4,29.05 v54.45,28.1
MEASURE  (via drill 0.6)
  Top 0.406: 68.19,28.19 U1.27 68.19,27.24 68.1,27.15 v67.95,27.15 | v53.82,43.34 56.98,43.34 57.62,42.7
  Top 0.508: R7.1 57.62,42.7 53.03,47.3 Q4.1
  Bottom 0.406: v67.95,27.15 67.95,25.88 66.68,24.61 64.29,26.99 64.29,30.96 58.9,36.35 54.77,36.35 53.82,37.31 v53.82,43.34
N$1
  Top 0.406: Q2.3 2.06,13.49 1.59,13.97 1.59,16.99 2.23,17.63 Q1.1 7.94,17.31 R5.1 8.57,14.29 8.57,13.33 8.85,13.05 13.81,13.05 Q5.1
N$2
  Top 0.508: Q3.1 51.75,42.55 Q4.3 51.75,44.44 R6.1
N$3
  Top 0.406: J2.2 31.58,52.44 31.58,53.3 31.31,53.58 29.65,53.58 29.37,53.3 29.37,52.44 J2.1
  Top 0.508: J2.2 33.5,50.53 U$1.P$60
N$4
  Top 0.406: 47.62,50.32 J1.1 47.62,49.95 47.62,48.93 47.34,48.65 45.37,48.65 45.04,48.98 J1.2
  Top 0.508: J1.2 44.88,50.48 C4.2 42.55,50.48 42.55,50.55 39.53,53.57 L1.1
N$5
  Top 0.508: C4.1 40.49,47.89 U$1.P$53
N$6
  Top 0.406: U$1.P$16 19.54,28.88 19.53,28.89 D3.1 17.54,32.79 13.97,36.35 12.08,36.35 Q7.3
  Top 0.508: Q7.3 C5.2
N$7
  Top 0.406: LED_R.A R23.2
N$8  (via drill 0.6)
  Top 0.406: R25.2 57.79,47.31 57.31,47.78 v57.31,47.94 | v45.24,6.03 43.02,8.25 LED_G.A
  Bottom 0.406: v57.31,47.94 53.98,44.61 52.71,44.61 50.8,42.7 50.8,6.03 v45.24,6.03
N$9
  Top 0.406: LED_R1.C 24.77,3.81 R8.2
N$13  (via drill 0.6)
  Top 0.305: D1.5 40.31,19.54 38.5,21.35 U$1.P$31
  Top 0.406: D1.5 41.2,19.54 v41.21,19.53 | v42.55,11.43 45.15,11.43 J3.C7
  Bottom 0.406: v41.21,19.53 41.21,12.76 v42.55,11.43
N$14
  Top 0.406: U$1.P$33 40.5,22.24 40.48,22.22 42.07,20.64 42.07,18.89 41.42,18.24 | D1.4 41.42,18.24 | 41.42,18.24 43.66,16 43.66,13.97 46.78,10.85 J3.C2
N$17
  Top 0.508: IO5.1 70.64,28.86 U1.29
N$32
  Top 0.406: R20.2 33.65,9.37 JP2.1
N$33
  Top 0.508: LED_R2.C R11.2
N$34
  Top 0.406: U$1.P$34 41.5,22.29 41.43,22.22 42.55,21.11 R22.2
N$36
  Top 0.508: L1.2 36.77,56.29 R13.2
N$37  (via drill 0.6)
  Top 0.406: 39.5,22.42 39.53,22.38 | U$1.P$32 39.53,23.84 39.53,22.38 | 39.53,22.38 v39.53,21.59 | v38.42,16.99 D1.3
  Bottom 0.406: v39.53,21.59 38.74,21.59 36.99,19.84 36.99,18.26 38.26,16.99 v38.42,16.99
N$38
  Top 0.508: R14.2 47.71,30.88 U$1.P$38
N$39
  Top 0.406: R16.2 47.47,27.15 47.47,29.53 47.12,29.88 U$1.P$37
N$40
  Top 0.305: D1.1 37,19.54 36.99,19.53 35.72,20.79 C7.2
  Top 0.406: D1.1 38.42,20.48 37.47,21.43 37.47,23.85 U$1.P$30
N$42
  Top 0.406: U$1.P$25 32.5,18.46 34.77,16.19 R20.1 36.04,14.6 R18.2
N$45
  Top 0.406: U$1.P$23 30.5,15.73 | 30.5,15.73 30.48,15.72 | 30.5,15.73 30.5,12.84 JP3.1
  Bottom 0.406: 30.48,12.86 JP3.1
NETLIGHT  (via drill 0.6)
  Top 0.406: Q6.1 20.15,50.97 v19.05,52.07 | v47.78,47.62 44.77,47.62 44.13,48.26 41.88,48.26 U$1.P$52
  Bottom 0.406: v19.05,52.07 19.69,52.7 44.77,52.7 47.78,49.69 v47.78,47.62
NRESET_OUT
  Top 0.508: R9.2 10.64,33.67 Q7.1
POWER  (via drill 0.6)
  Top 0.406: Q2.1 6.67,11.58 6.67,10.64 8.88,8.42 R12.1 11.11,7.94 v11.11,3.17 | v82.55,27.15 81.85,27.84 81.57,27.84 80.89,28.52 U1.37
  Bottom 0.406: v11.11,3.17 11.11,2.7 12.7,1.11 56.2,1.11 57.63,2.54 57.63,7.78 60.48,10.64 70.49,10.64 76.84,4.29 78.9,4.29 82.55,7.94 v82.55,27.15
PWR_STAT
  Top 0.508: U$1.P$66 27.46,47.91 27.46,49.21 27.29,49.39 25.84,49.39 25.4,49.83 Q9.1
PWRKEY_IN
  Top 0.406: Q8.3 18.4,49.21 D2.1
  Top 0.508: U$1.P$1 19.31,43.88 C6.2 18.52,44.66 18.52,47.19 Q8.3
PWRKEY_OUT
  Top 0.508: R10.2 Q8.1
RST  (via drill 0.6)
  Top 0.406: RST.2 RST.1 | U1.3 79.62,48.05 v79.53,48.14
  Top 0.508: C3.1 R2.1 75.72,12.86 JP1.2
  Bottom 0.406: RST.1 72.75,51.71 74.93,49.53 78.15,49.53 v79.53,48.14 80.92,48.14 81.28,47.78 81.28,13.49 80.65,12.86 JP1.2
RX
  Top 0.508: JP1.5 81.6,20.48 82.23,21.11 82.23,23.49 80.8,24.92 78.58,24.92 76.99,26.51 76.99,28.86 U1.34
TILT1
  Top 0.406: U1.6 75.81,48.49 75.41,48.89 74.3,48.89 72.87,50.32 60.65,50.32 R3.1 57.95,52.07 TILT1.1
TILT2  (via drill 0.6)
  Top 0.406: U1.7 74.54,48.01 74.3,48.26 73.82,48.26 72.39,49.69 60.17,49.69 59.06,50.8 v56.99,50.8 | TILT2.1 57.95,55.56 R4.1
  Bottom 0.406: v56.99,50.8 56.99,54.61 56.04,55.56 TILT2.1
TX
  Top 0.508: JP1.4 80.65,17.94 83.19,20.48 83.19,24.61 82.07,25.72 78.9,25.72 78.26,26.35 78.26,28.86 U1.35
UC_DRT  (via drill 0.6)
  Top 0.406: U1.13 66.46,46.48 66.46,46.05 65.65,45.24 61.75,45.24 60.96,44.45 60.96,30.96 v61.75,30.16 | U2.16 64.76,22.55 v65.09,22.22
  Bottom 0.406: v65.09,22.22 65.09,24.45 61.75,27.78 v61.75,30.16
UC_RI  (via drill 0.6)
  Top 0.406: U1.16 61.92,42.39 61.6,42.07 61.6,31.75 v61.91,31.43
  Top 0.508: U2.17 61.95,23.22 65.88,23.22 66.68,22.43 v66.68,22.27
  Bottom 0.406: v66.68,22.27 65.65,23.3 65.65,24.68 62.87,27.46 62.87,30.48 v61.91,31.43
UC_RX
  Top 0.508: U2.20 68.35,25.15 68.48,25.15 68.5,25.25 U1.28
UC_SCL  (via drill 0.6)
  Top 0.406: U2.14 63.68,21.25 64.32,20.6 65.6,20.6 66.68,19.53 v69.69,19.53 | 79.69,28.88 v79.69,26.99
  Top 0.508: U1.36 79.69,28.88
  Bottom 0.406: v69.69,19.53 70.64,19.53 78.11,26.99 v79.69,26.99
UC_SDA  (via drill 0.6)
  Top 0.406: U2.15 63.82,21.9 64.55,21.16 67.15,21.16 | U1.33 75.81,27.06 v75.88,26.99
  Top 0.508: v68.26,22.22 67.2,21.16 67.15,21.16
  Bottom 0.406: v75.88,26.99 75.63,26.73 75.63,25.47 71.12,20.95 68.9,20.95 68.26,21.59 v68.26,22.22
UC_TX  (via drill 0.6)
  Top 0.406: U2.18 68.86,23.85 69.85,22.86 v69.85,22.22 | v72.87,25.72 72.87,26.83 72,27.69 U1.30
  Bottom 0.406: v69.85,22.22 71.6,22.22 72.87,23.49 v72.87,25.72
V+  (via drill 0.6)  (2 unrouted)
  Top 0.406: Q1.3 8.58,19.84 10.48,19.84 10.95,19.37 10.95,17.62 12.24,16.34 Q5.3 16.66,16.34 v16.99,16.67 | v18.89,6.83 18.89,5.71 19.37,5.23 LED_R1.A | U$1.P$55 38.42,47.96 v38.42,49.69 | R13.1 36.67,51.43 C18.2 | LED_R2.A 34.47,56.51 35.31,57.35 40.29,57.35 C16.2
  Top 0.508: C16.2 C17.2 C8.2 C11.2 | R13.1 35.86,53.35 LED_R2.A | U$1.P$57 36.5,50.94 C18.2
  Bottom 0.406: v18.89,6.83 18.89,14.76 v16.99,16.67 16.99,16.73 18.09,17.83 18.1,26.35 18.73,26.99 27.62,26.99 38.42,37.78 v38.42,49.69
VCC
  Top 0.406: Q1.2 10.79,16.37 R5.2 | U4.1 26.75,7.07 25.88,6.19 21.43,6.19 19.05,8.57 X1.2 X2.2 16.08,13.77 Q5.2 14.66,15.2 13.17,15.2 12.89,14.92 R5.2 | R5.2 11.11,14.6
  Top 0.508: B1.+ 19.08,20.32 C12.1 C13.1 18.24,16.51 15.87,14.14 Q5.2

### Text on the board
tNames: gnd / / V+ | V+ / / DHT / / gnd | IO0 | Rx | Tx | Vcc | Rst | GND
bNames: -- MIC + | -- SPK + | V+ / / GND | GND / / DHT / / V+ | IO36 / / IO39 | ESP32 SIM800L / v1.62 | Christian.PETER / @univ-cotedazur.fr | MTMS / / MTCK / / MTDO / / MTDI / / GND | IO0 / / RX / / TX / / 3V3 / / RST / / GND | VCC / / GND